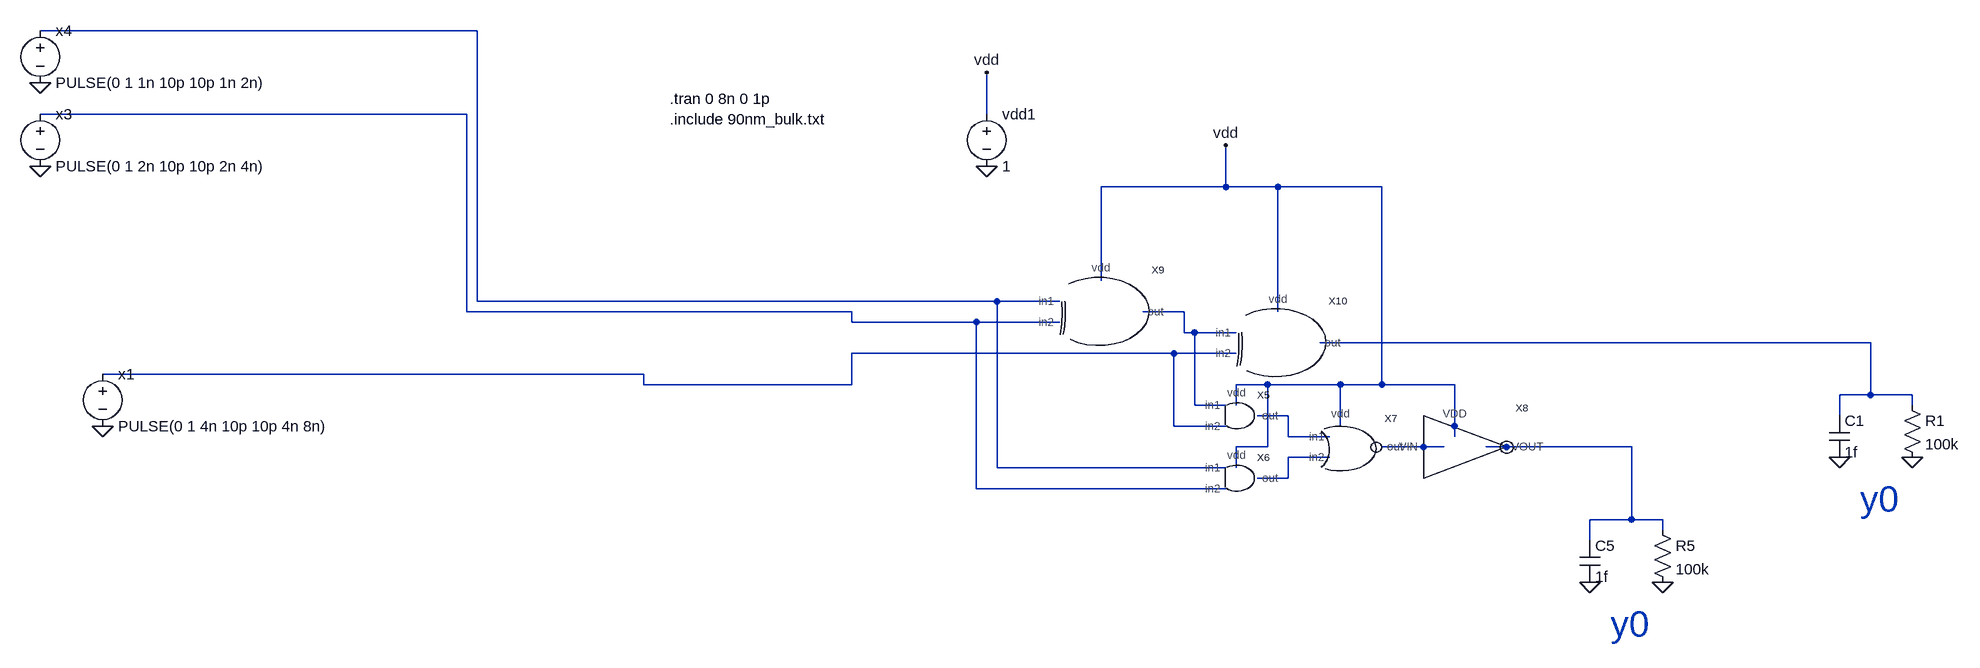
[diagram p0: schematic adder-test.asc]
adder-test.asc, the LTspice schematic file:
Version 4
SHEET 1 4180 1316
WIRE 576 -256 -96 -256
WIRE 560 -128 -96 -128
WIRE 1360 -128 1360 -192
WIRE 1728 -16 1728 -80
WIRE 1728 -16 1536 -16
WIRE 1808 -16 1728 -16
WIRE 1968 -16 1808 -16
WIRE 1536 128 1536 -16
WIRE 576 160 576 -256
WIRE 1376 160 576 160
WIRE 1472 160 1376 160
WIRE 560 176 560 -128
WIRE 1152 176 560 176
WIRE 1664 176 1600 176
WIRE 1808 176 1808 -16
WIRE 1152 192 1152 176
WIRE 1344 192 1152 192
WIRE 1472 192 1344 192
WIRE 1664 208 1664 176
WIRE 1680 208 1664 208
WIRE 1744 208 1680 208
WIRE 2720 224 1872 224
WIRE 1648 240 1152 240
WIRE 1744 240 1648 240
WIRE 832 272 0 272
WIRE 832 288 832 272
WIRE 1152 288 1152 240
WIRE 1152 288 832 288
WIRE 1792 288 1744 288
WIRE 1904 288 1792 288
WIRE 1968 288 1968 -16
WIRE 1968 288 1904 288
WIRE 2080 288 1968 288
WIRE 2720 304 2720 224
WIRE 2720 304 2672 304
WIRE 2784 304 2720 304
WIRE 1680 320 1680 208
WIRE 1728 320 1680 320
WIRE 1744 320 1744 288
WIRE 2784 320 2784 304
WIRE 1824 336 1776 336
WIRE 2672 336 2672 304
WIRE 1648 352 1648 240
WIRE 1728 352 1648 352
WIRE 1904 352 1904 288
WIRE 1824 368 1824 336
WIRE 1888 368 1824 368
WIRE 2080 368 2080 288
WIRE 1792 384 1792 288
WIRE 1792 384 1744 384
WIRE 2064 384 1968 384
WIRE 2352 384 2128 384
WIRE 1888 400 1824 400
WIRE 1376 416 1376 160
WIRE 1728 416 1376 416
WIRE 1744 416 1744 384
WIRE 1824 432 1824 400
WIRE 1824 432 1776 432
WIRE 1344 448 1344 192
WIRE 1728 448 1344 448
WIRE 2352 496 2352 384
WIRE 2352 496 2288 496
WIRE 2400 496 2352 496
WIRE 2400 512 2400 496
WIRE 2288 528 2288 496
FLAG -96 -48 0
FLAG -96 -176 0
FLAG 1360 -48 0
FLAG 1360 -192 vdd
FLAG 2672 400 0
FLAG 2784 400 0
FLAG 2288 592 0
FLAG 2400 592 0
FLAG 1728 -80 vdd
FLAG 0 352 0
SYMBOL voltage -96 -144 R0
WINDOW 123 0 0 Left 2
WINDOW 39 0 0 Left 2
SYMATTR InstName x3
SYMATTR Value PULSE(0 1 2n 10p 10p 2n 4n)
SYMBOL voltage -96 -272 R0
WINDOW 123 0 0 Left 2
WINDOW 39 0 0 Left 2
SYMATTR InstName x4
SYMATTR Value PULSE(0 1 1n 10p 10p 1n 2n)
SYMBOL voltage 1360 -144 R0
WINDOW 123 0 0 Left 2
WINDOW 39 0 0 Left 2
SYMATTR InstName vdd1
SYMATTR Value 1
SYMBOL res 2768 304 R0
SYMATTR InstName R1
SYMATTR Value 100k
SYMBOL cap 2656 336 R0
SYMATTR InstName C1
SYMATTR Value 1f
SYMBOL res 2384 496 R0
SYMATTR InstName R5
SYMATTR Value 100k
SYMBOL cap 2272 528 R0
SYMATTR InstName C5
SYMATTR Value 1f
SYMBOL and 1744 336 R0
SYMATTR InstName X5
SYMBOL and 1744 432 R0
SYMATTR InstName X6
SYMBOL nor 1904 384 R0
SYMATTR InstName X7
SYMBOL inverter 2080 384 R0
SYMATTR InstName X8
SYMBOL xor 1536 176 R0
SYMATTR InstName X9
SYMBOL xor 1808 224 R0
SYMATTR InstName X10
SYMBOL voltage 0 256 R0
WINDOW 123 0 0 Left 2
WINDOW 39 0 0 Left 2
SYMATTR InstName x1
SYMATTR Value PULSE(0 1 4n 10p 10p 4n 8n)
TEXT 872 -120 Left 2 !.include 90nm_bulk.txt
TEXT 872 -152 Left 2 !.tran 0 8n 0 1p
TEXT 2704 464 Left 5 ;y0
TEXT 2320 656 Left 5 ;y0

The netlist it stands for:
* adder-test.asc
V§x3 N002 0 PULSE(0 1 2n 10p 10p 2n 4n)
V§x4 N001 0 PULSE(0 1 1n 10p 10p 1n 2n)
vdd1 vdd 0 1
R1 N004 0 100k
C1 N004 0 1f
R5 N008 0 100k
C5 N008 0 1f
XX5 N003 N005 vdd N006 and  ; pins in1 in2 vdd out
XX6 N001 N002 vdd N009 and  ; pins in1 in2 vdd out
XX7 N006 N009 vdd N007 nor  ; pins in1 in2 vdd out
XX8 vdd N008 N007 inverter  ; pins VDD VOUT VIN
XX9 N001 N002 vdd N003 xor  ; pins in1 in2 vdd out
XX10 N003 N005 vdd N004 xor  ; pins in1 in2 vdd out
V§x1 N005 0 PULSE(0 1 4n 10p 10p 4n 8n)
.include 90nm_bulk.txt
.tran 0 8n 0 1p
* y0
* y0
.backanno
.end